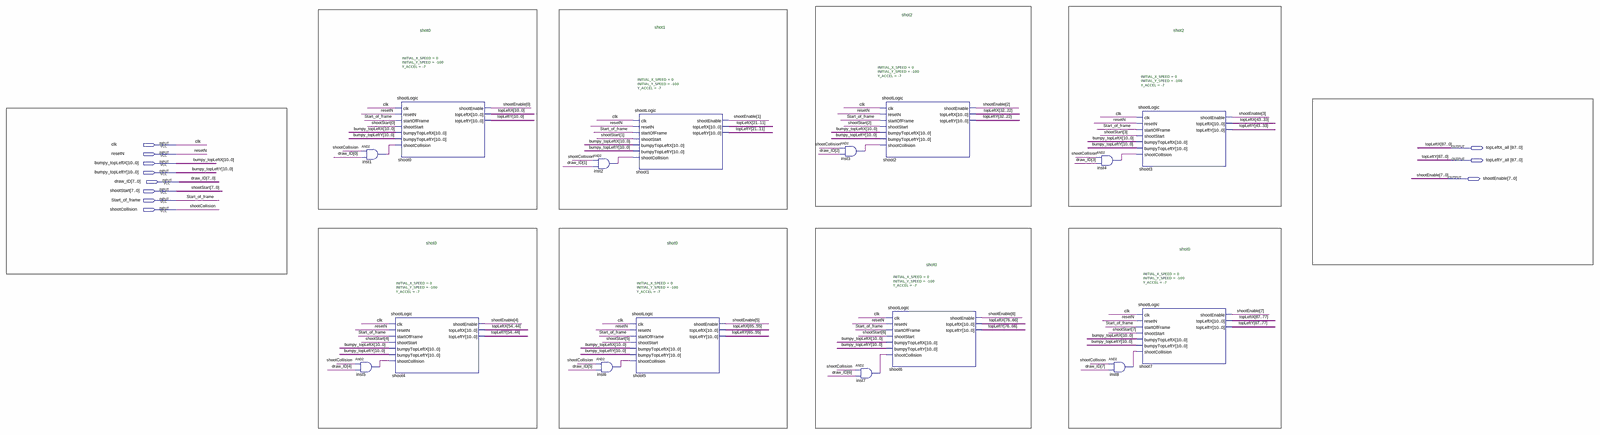
[diagram p0: schematic sheet, whole]
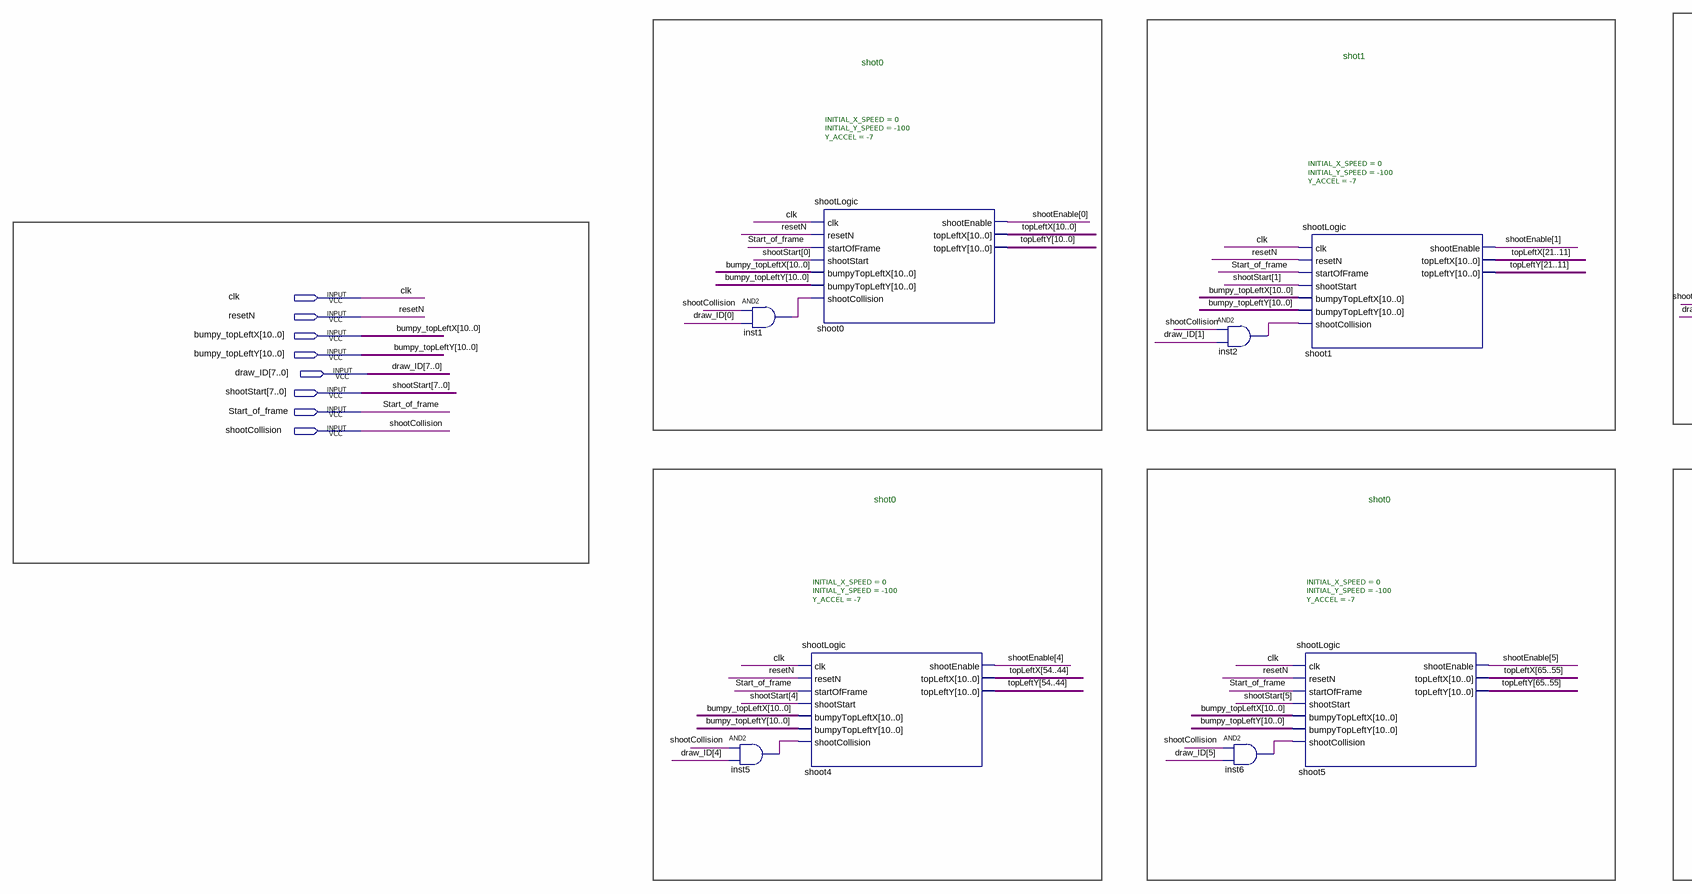
[diagram p1: schematic sheet, left part]
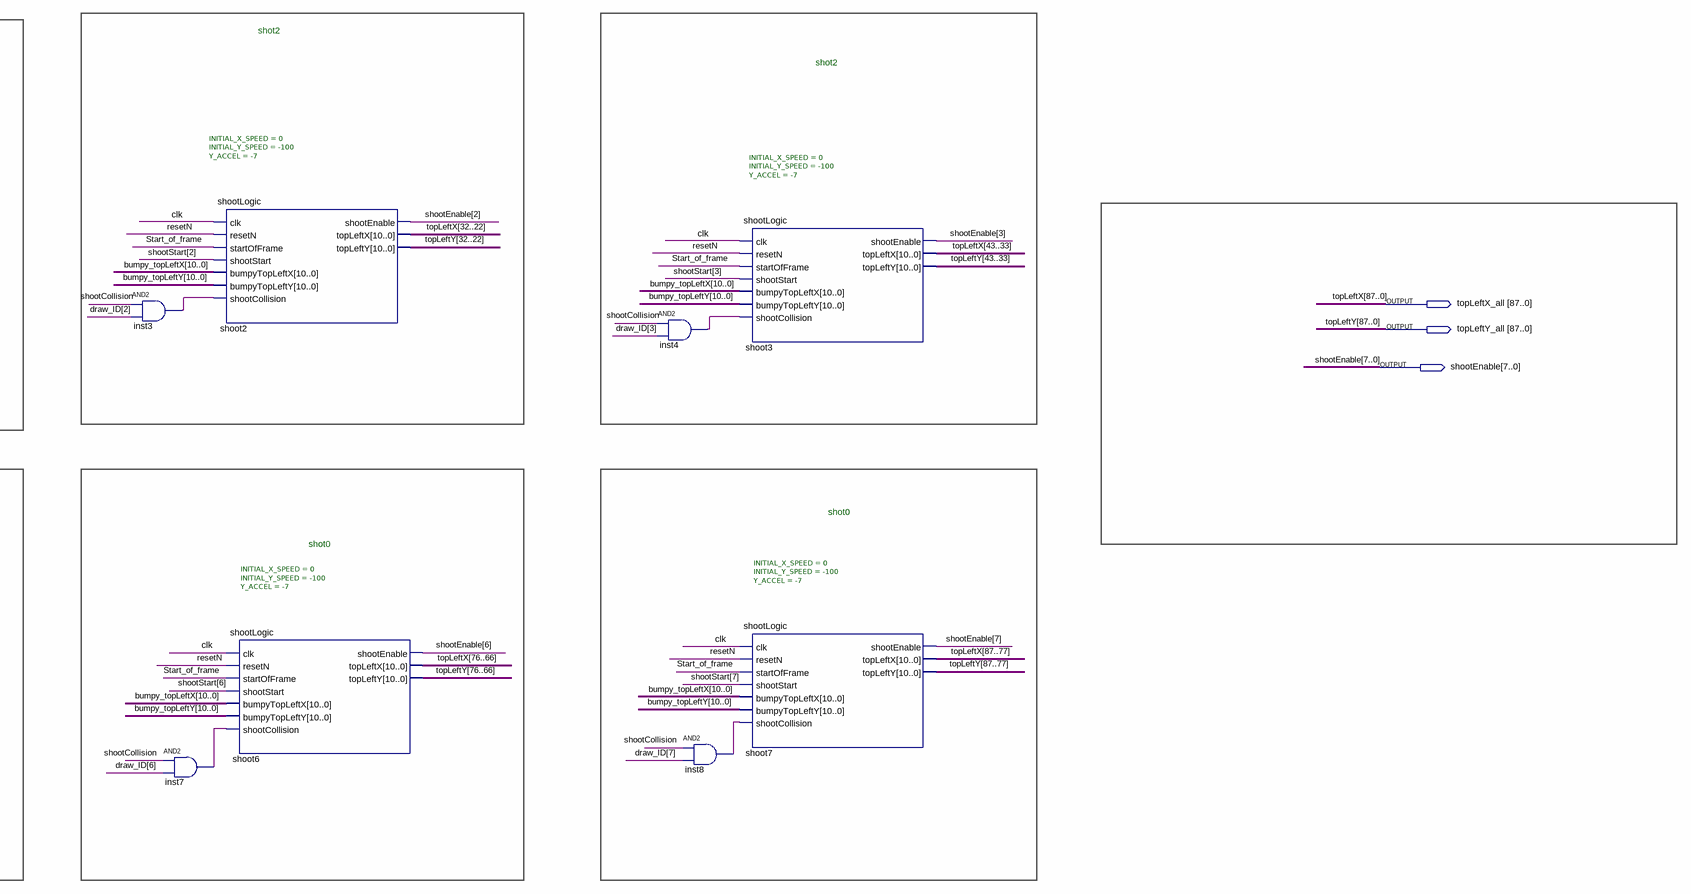
[diagram p2: schematic sheet, right part]
// Quartus schematic shootLogicMaster.bdf as structural Verilog: 16 symbols, 11 pins
module shootLogicMaster (
  input  clk,
  input  resetN,
  input  [10:0] bumpy_topLeftX,
  input  [10:0] bumpy_topLeftY,
  input  [7:0] draw_ID,
  input  [7:0] shootStart,
  input  Start_of_frame,
  input  shootCollision,
  output [87:0] topLeftX_all,
  output [87:0] topLeftY_all,
  output [7:0] shootEnable
);

  wire inst1_out, inst2_out, inst3_out, inst4_out, inst5_out, inst6_out, inst7_out, inst8_out;

  and inst1 (inst1_out, shootCollision, draw_ID[0]);
  and inst5 (inst5_out, shootCollision, draw_ID[4]);
  shootLogic #(.INITIAL_X_SPEED(0), .INITIAL_Y_SPEED(-100), .Y_ACCEL(-7)) shoot0 (
    .clk(clk), .resetN(resetN), .startOfFrame(Start_of_frame), .shootStart(shootStart[0]),
    .bumpyTopLeftX(bumpy_topLeftX), .bumpyTopLeftY(bumpy_topLeftY), .shootCollision(inst1_out),
    .shootEnable(shootEnable[0]), .topLeftX(topLeftX_all[10:0]), .topLeftY(topLeftY_all[10:0]));
  shootLogic #(.INITIAL_X_SPEED(0), .INITIAL_Y_SPEED(-100), .Y_ACCEL(-7)) shoot4 (
    .clk(clk), .resetN(resetN), .startOfFrame(Start_of_frame), .shootStart(shootStart[4]),
    .bumpyTopLeftX(bumpy_topLeftX), .bumpyTopLeftY(bumpy_topLeftY), .shootCollision(inst5_out),
    .shootEnable(shootEnable[4]), .topLeftX(topLeftX_all[54:44]), .topLeftY(topLeftY_all[54:44]));
  and inst2 (inst2_out, shootCollision, draw_ID[1]);
  and inst6 (inst6_out, shootCollision, draw_ID[5]);
  shootLogic #(.INITIAL_X_SPEED(0), .INITIAL_Y_SPEED(-100), .Y_ACCEL(-7)) shoot1 (
    .clk(clk), .resetN(resetN), .startOfFrame(Start_of_frame), .shootStart(shootStart[1]),
    .bumpyTopLeftX(bumpy_topLeftX), .bumpyTopLeftY(bumpy_topLeftY), .shootCollision(inst2_out),
    .shootEnable(shootEnable[1]), .topLeftX(topLeftX_all[21:11]), .topLeftY(topLeftY_all[21:11]));
  shootLogic #(.INITIAL_X_SPEED(0), .INITIAL_Y_SPEED(-100), .Y_ACCEL(-7)) shoot5 (
    .clk(clk), .resetN(resetN), .startOfFrame(Start_of_frame), .shootStart(shootStart[5]),
    .bumpyTopLeftX(bumpy_topLeftX), .bumpyTopLeftY(bumpy_topLeftY), .shootCollision(inst6_out),
    .shootEnable(shootEnable[5]), .topLeftX(topLeftX_all[65:55]), .topLeftY(topLeftY_all[65:55]));
  and inst3 (inst3_out, shootCollision, draw_ID[2]);
  and inst7 (inst7_out, shootCollision, draw_ID[6]);
  shootLogic #(.INITIAL_X_SPEED(0), .INITIAL_Y_SPEED(-100), .Y_ACCEL(-7)) shoot2 (
    .clk(clk), .resetN(resetN), .startOfFrame(Start_of_frame), .shootStart(shootStart[2]),
    .bumpyTopLeftX(bumpy_topLeftX), .bumpyTopLeftY(bumpy_topLeftY), .shootCollision(inst3_out),
    .shootEnable(shootEnable[2]), .topLeftX(topLeftX_all[32:22]), .topLeftY(topLeftY_all[32:22]));
  shootLogic #(.INITIAL_X_SPEED(0), .INITIAL_Y_SPEED(-100), .Y_ACCEL(-7)) shoot6 (
    .clk(clk), .resetN(resetN), .startOfFrame(Start_of_frame), .shootStart(shootStart[6]),
    .bumpyTopLeftX(bumpy_topLeftX), .bumpyTopLeftY(bumpy_topLeftY), .shootCollision(inst7_out),
    .shootEnable(shootEnable[6]), .topLeftX(topLeftX_all[76:66]), .topLeftY(topLeftY_all[76:66]));
  and inst4 (inst4_out, shootCollision, draw_ID[3]);
  and inst8 (inst8_out, shootCollision, draw_ID[7]);
  shootLogic #(.INITIAL_X_SPEED(0), .INITIAL_Y_SPEED(-100), .Y_ACCEL(-7)) shoot3 (
    .clk(clk), .resetN(resetN), .startOfFrame(Start_of_frame), .shootStart(shootStart[3]),
    .bumpyTopLeftX(bumpy_topLeftX), .bumpyTopLeftY(bumpy_topLeftY), .shootCollision(inst4_out),
    .shootEnable(shootEnable[3]), .topLeftX(topLeftX_all[43:33]), .topLeftY(topLeftY_all[43:33]));
  shootLogic #(.INITIAL_X_SPEED(0), .INITIAL_Y_SPEED(-100), .Y_ACCEL(-7)) shoot7 (
    .clk(clk), .resetN(resetN), .startOfFrame(Start_of_frame), .shootStart(shootStart[7]),
    .bumpyTopLeftX(bumpy_topLeftX), .bumpyTopLeftY(bumpy_topLeftY), .shootCollision(inst8_out),
    .shootEnable(shootEnable[7]), .topLeftX(topLeftX_all[87:77]), .topLeftY(topLeftY_all[87:77]));

  // Other names for the same wires on the sheet: topLeftX[87:0] = topLeftX_all; topLeftY[87:0] = topLeftY_all

  // Notes on the sheet:
  //   shot2
  //   shot1
  //   shot0
  //   shot2
  //   shot0
  //   shot0
  //   shot0
  //   shot0
endmodule
